# Altium schematic sheet Main.SchDoc: Main
size A4; SheetNumber: 2; SheetTotal: 4
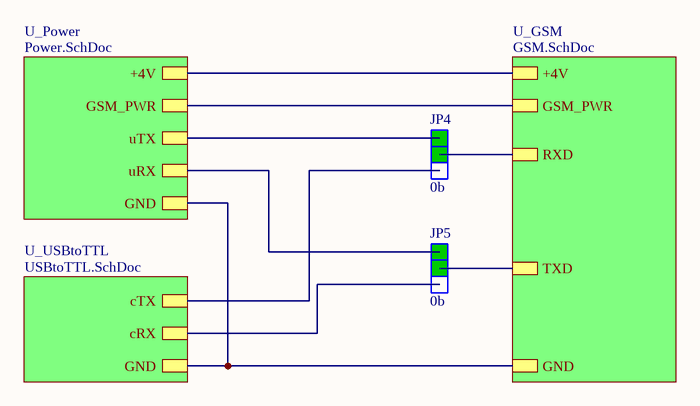
[diagram p0: Main.SchDoc]

## Parts
JP4  0b  [jumper selector]
JP5  0b  [jumper selector]

## Sub-sheets
U_GSM = GSM.SchDoc: +4V, GND, GSM_PWR, TXD, RXD
U_Power = Power.SchDoc: uRX, uTX, +4V, GND, GSM_PWR
U_USBtoTTL = USBtoTTL.SchDoc: GND, cTX, cRX

## Nets
NetJP4_1: JP4.1 ; sheet U_Power/uTX
NetJP4_2: JP4.2 ; sheet U_GSM/RXD
NetJP4_3: JP4.3 ; sheet U_USBtoTTL/cTX
NetJP5_1: JP5.1 ; sheet U_Power/uRX
NetJP5_2: JP5.2 ; sheet U_GSM/TXD
NetJP5_3: JP5.3 ; sheet U_USBtoTTL/cRX
(unnamed): sheet U_Power/+4V, sheet U_GSM/+4V
(unnamed): sheet U_Power/GND, sheet U_GSM/GND, sheet U_USBtoTTL/GND
(unnamed): sheet U_Power/GSM_PWR, sheet U_GSM/GSM_PWR

## Notes on the sheet
- Title:
- Project:
- Drawn by:
- Revision:
- Hossein Bagheri
- Company:
- Sheet
- of

## Library data of the parts
JP4 JP5 = SW_Other_JSelector_THT: Jumper Selector; Rating: Rating?; Inflow: 5145; Validation: Valid; Package: Dip; Type: Selector; Value: 0b